# Altium schematic sheet PCB_Power1D.SchDoc
size A4; Organization: Altium Limited; Address1: L3, 12a Rodborough Rd; Address2: Frenchs Forest; Address3: NSW; Address4: Australia 2086; DocumentNumber: 2; SheetNumber: 2; SheetTotal: 7
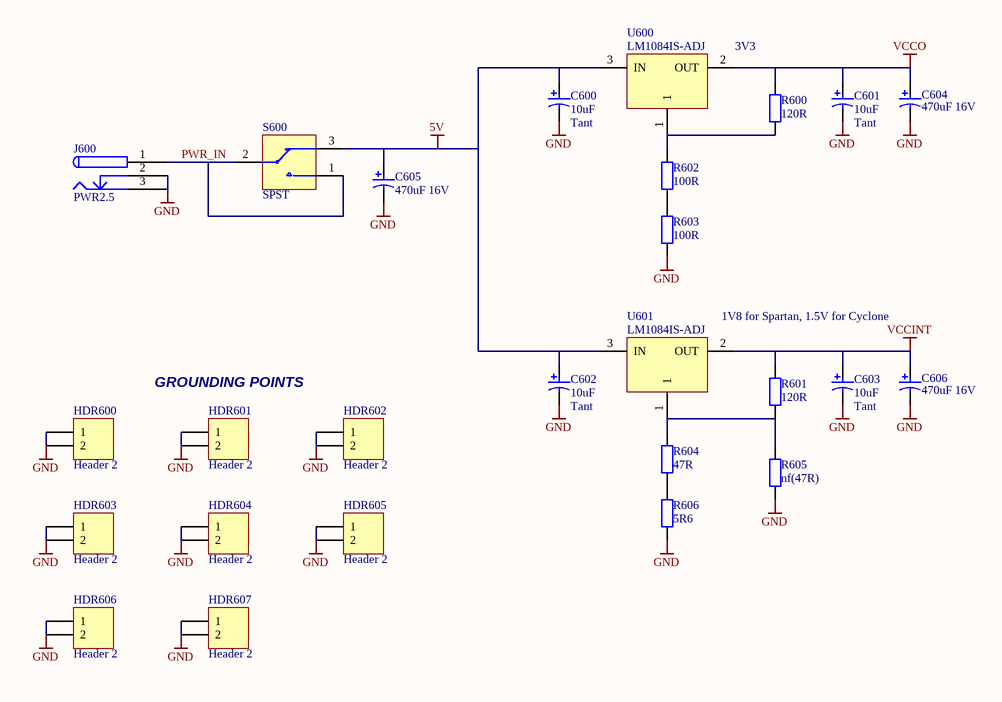
[diagram p0: PCB_Power1D.SchDoc]

## Parts
C600  10uF  Capacitor Type: Tant  [MCCT-B]
C601  10uF  Capacitor Type: Tant  [MCCT-B]
C602  10uF  Capacitor Type: Tant  [MCCT-B]
C603  10uF  Capacitor Type: Tant  [MCCT-B]
C604  470uF 16V  [RB8/3.5]
C605  470uF 16V  [RB8/3.5]
C606  470uF 16V  [RB8/3.5]
HDR600  Header 2  [HDR1X2]
HDR601  Header 2  [HDR1X2]
HDR602  Header 2  [HDR1X2]
HDR603  Header 2  [HDR1X2]
HDR604  Header 2  [HDR1X2]
HDR605  Header 2  [HDR1X2]
HDR606  Header 2  [HDR1X2]
HDR607  Header 2  [HDR1X2]
J600  PWR2.5  [PWR2.5]
R600  120R  [CC2012-0805]
R601  120R  [CC2012-0805]
R602  100R  [CC2012-0805]
R603  100R  [CC2012-0805]
R604  47R  [CC2012-0805]
R605  nf(47R)  [CC2012-0805]
R606  5R6  [CC2012-0805]
S600  SPST  [PCB_SWITCH]
U600  LM1084IS-ADJ  [TO-263]
U601  LM1084IS-ADJ  [TO-263]

## Nets
5V: C600.1 C602.1 C605.1 S600.3 U600.3(IN) U601.3(IN)
GND: C600.2 C601.2 C602.2 C603.2 C604.2 C605.2 C606.2 HDR600.1 HDR600.2 HDR601.1 HDR601.2 HDR602.1 HDR602.2 HDR603.1 HDR603.2 HDR604.1 HDR604.2 HDR605.1 HDR605.2 HDR606.1 HDR606.2 HDR607.1 HDR607.2 J600.2 J600.3 R603.1 R605.1 R606.1
VCCINT: C603.1 C606.1 R601.2 U601.2(OUT)
VCCO: C601.1 C604.1 R600.2 U600.2(OUT)
PWR_IN: J600.1 S600.1 S600.2
NetR600_1: R600.1 R602.2 U600.1
NetR601_1: R601.1 R604.2 R605.2 U601.1
NetR602_1: R602.1 R603.2
NetR604_1: R604.1 R606.2

## Notes on the sheet
- 3V3
- (near U601) 1V8 for Spartan, 1.5V for Cyclone
- (near HDR601) GROUNDING POINTS
- Title
- Size:
- Date:
- A4
- Number:
- Time:
- Revision:
- Sheet
- of
- File:

## Library data of the parts
C600-C606 = CAP_POLAR: Polar Capacitor; Fitted: True
HDR600-HDR607 = Header 2: Header, 2-Pin; Manufacturer: Generic Components; Class I: Connector; Fitted: True; Revision: July-2002: Re-released for DXP Platform.; Publisher: Altium Limited
J600 = PWR2.5: Low Voltage Power Supply Sonnector; Fitted: True
R600-R604 R606 = Res2: Resistor; Manufacturer: Generic Components; Class I: Passive; Published: 8-Jun-2000; Revision: July-2002: Re-released for DXP Platform.; Publisher: Altium Limited; Class II: Resistor
R605 = Res2: Resistor; Manufacturer: Generic Components; Class I: Passive; Fitted: False; Published: 8-Jun-2000; Revision: July-2002: Re-released for DXP Platform.; Publisher: Altium Limited; Class II: Resistor
S600 = PCB_MOUNT_SWITCH: SPDT Subminiature Toggle Switch; Fitted: True
U600 U601 = LM1084IS-ADJ: 5A Low Dropout Possitive Regulators; Fitted: True